# Altium schematic sheet Risc_V.SchDoc
size A4; SheetNumber: 6; SheetTotal: 7
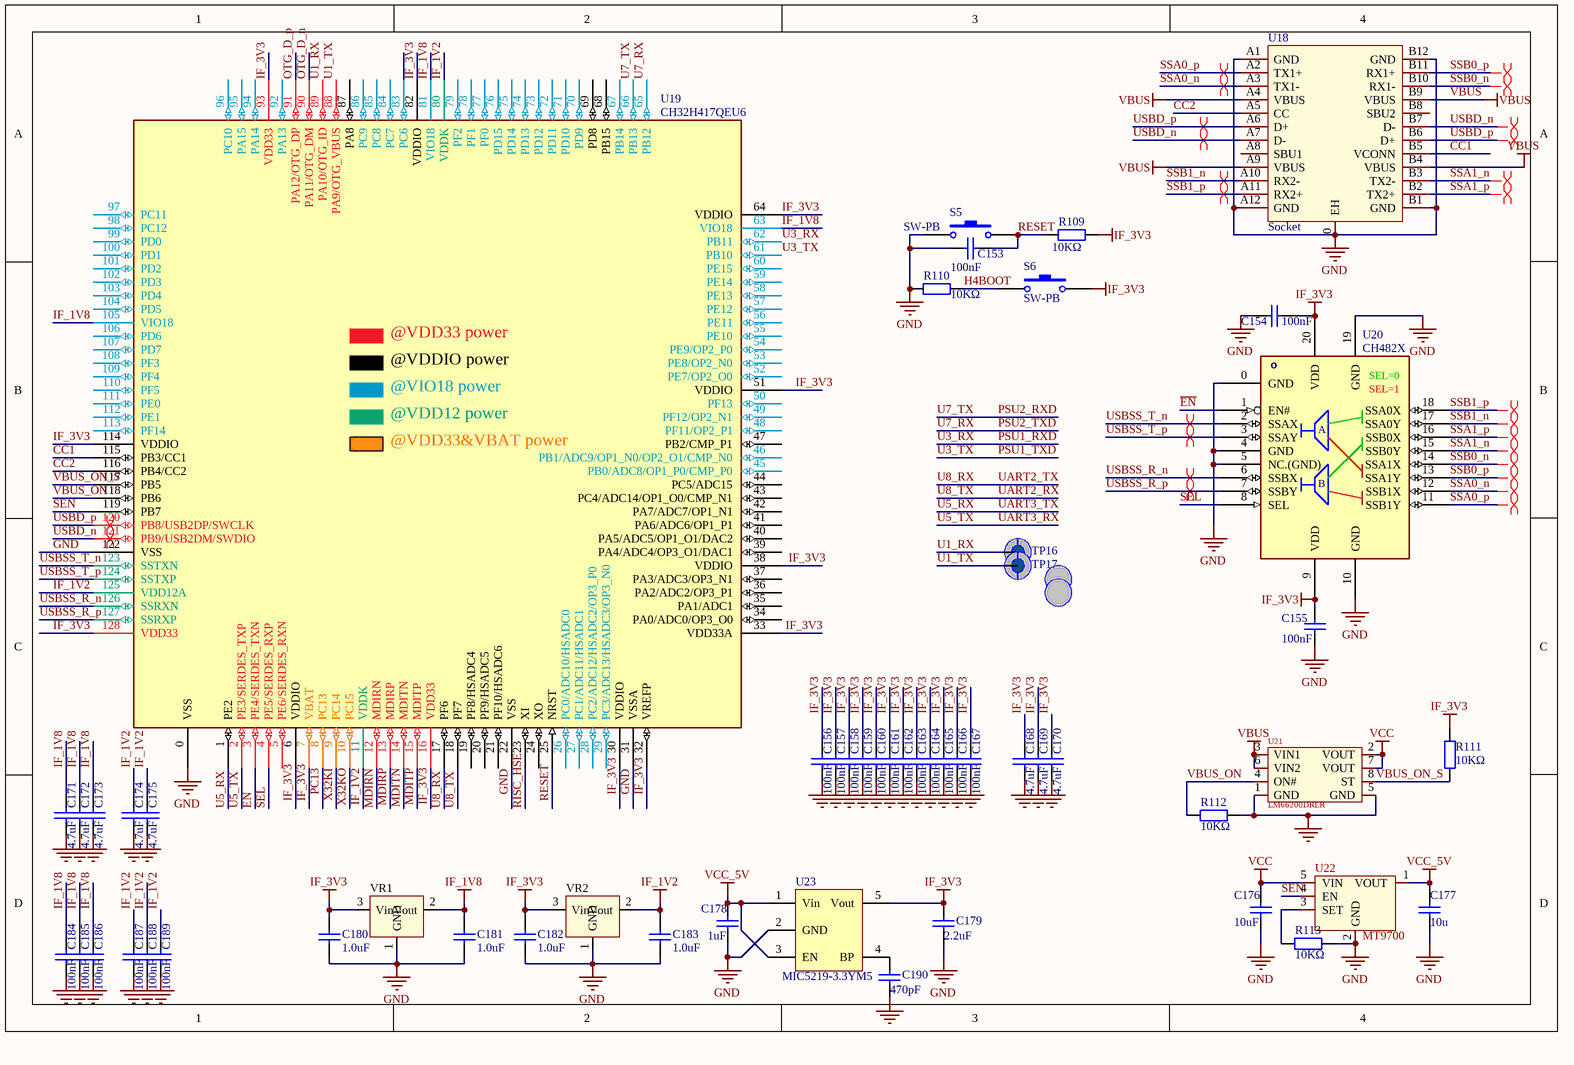
[diagram p0: Risc_V.SchDoc]

## Parts
C153  100nF  [0805_C]
C154  100nF  [0201]
C155  100nF  [0201]
C156  100nF  [0201]
C157  100nF  [0201]
C158  100nF  [0201]
C159  100nF  [0201]
C160  100nF  [0201]
C161  100nF  [0201]
C162  100nF  [0201]
C163  100nF  [0201]
C164  100nF  [0201]
C165  100nF  [0201]
C166  100nF  [0201]
C167  100nF  [0201]
C168  4.7uF  [0805_C]
C169  4.7uF  [0805_C]
C170  4.7uF  [0805_C]
C171  4.7uF  [0805_C]
C172  4.7uF  [0805_C]
C173  4.7uF  [0805_C]
C174  4.7uF  [0805_C]
C175  4.7uF  [0805_C]
C176  10uF  [0805_C]
C177  10u  [0805_C]
C178  1uF  [0805_C]
C179  2.2uF  [0805_C]
C180  1.0uF  [0805_C]
C181  1.0uF  [0805_C]
C182  1.0uF  [0805_C]
C183  1.0uF  [0805_C]
C184  100nF  [0201]
C185  100nF  [0201]
C186  100nF  [0201]
C187  100nF  [0201]
C188  100nF  [0201]
C189  100nF  [0201]
C190  470pF  [0805_C]
R109  10KΩ  [0805_R]
R110  10KΩ  [0805_R]
R111  10KΩ  [0805_R]
R112  10KΩ  [0201]
R113  10KΩ  [0805_R]
S5  SW-PB  [SW-3*4-2P]
S6  SW-PB  [SW-3*4-2P]
TP16  test-point  [POINT]  (value not drawn)
TP17  test-point  [POINT]  (value not drawn)
U18  Socket  [USB Type C 24pin全后贴]
U19  CH32H417QEU6  [QFN128_12.3X12.3]
U20  CH482X  [QFN20_2.5X4.5]
U21  LM66200DRLR  [SOT-583-8_L2.1-W1.2-P0.50-LS1.6-BL]
U22  MT9700  [SOT-23-5]
U23  MIC5219-3.3YM5  [SOT-23-5]
VR1  XC6206P332MR-G  [SOT-23-3_L2.9-W1.6-P1.90-LS2.8-BR]  (value not drawn)
VR2  XC6206P332MR-G  [SOT-23-3_L2.9-W1.6-P1.90-LS2.8-BR]  (value not drawn)

## Nets
GND: C153.1 C154.2 C155.1 C156.2 C157.1 C158.2 C159.2 C160.1 C161.2 C162.1 C163.2 C164.2 C165.1 C166.1 C167.1 C168.2 C169.2 C170.2 C171.2 C172.1 C173.2 C174.2 C175.1 C176.1 C177.1 C178.1 C179.1 C180.1 C181.1 C182.1 C183.1 C184.1 C185.1 C186.2 C187.1 C188.1 C189.1 C190.1 R110.1 R112.1 R113.1 S5.1 U18.0(EH) U18.A1(GND) U18.A12(GND) U18.B1(GND) U18.B12(GND) U19.0(VSS) U19.22(VSS) U19.31(VSSA) U19.122(VSS) U20.0(GND) U20.4(GND) U20.5(NC.(GND)) U20.10(GND) U20.19(GND) U21.1(GND) U21.5(GND) U22.2(GND) U23.2(GND) VR1.1(GND) VR2.1(GND)
IF_1V2: C174.1 C175.2 C183.2 C187.2 C188.2 C189.2 U19.11(VDDK) U19.80(VDDK) U19.125(VDD12A) VR2.2(Vout)
IF_1V8: C171.1 C172.2 C173.1 C181.2 C184.2 C185.2 C186.1 U19.63(VIO18) U19.81(VIO18) U19.105(VIO18) VR1.2(Vout)
IF_3V3: C154.1 C155.2 C156.1 C157.2 C158.1 C159.1 C160.2 C161.1 C162.2 C163.1 C164.1 C165.2 C166.2 C167.2 C168.1 C169.1 C170.1 C179.2 C180.2 C182.2 R109.2 R111.2 S6.2 U19.6(VDDIO) U19.7(VBAT) U19.16(VDD33) U19.30(VDDIO) U19.32(VREFP) U19.33(VDD33A) U19.38(VDDIO) U19.51(VDDIO) U19.64(VDDIO) U19.82(VDDIO) U19.93(VDD33) U19.114(VDDIO) U19.128(VDD33) U20.9(VDD) U20.20(VDD) U23.5(Vout) VR1.3(Vin) VR2.3(Vin)
VBUS: U18.A4(VBUS) U18.A9(VBUS) U18.B4(VBUS) U18.B9(VBUS) U21.3(VIN1) U21.6(VIN2)
VCC: C176.2 U21.2(VOUT) U21.7(VOUT) U22.5(VIN)
VCC_5V: C177.2 C178.2 U22.1(VOUT) U23.1(Vin) U23.3(EN)
CC1: U18.B5(VCONN) U19.115(PB3/CC1)
CC2: U18.A5(CC) U19.116(PB4/CC2)
~{EN}: U19.3(PE4/SERDES_TXN) U20.1(EN#)
H4BOOT: R110.2 S6.1
MDIRN: U19.12(MDIRN)
MDIRP: U19.13(MDIRP)
MDITN: U19.14(MDITN)
MDITP: U19.15(MDITP)
OTG_D_n: U19.90(PA11/OTG_DM)
OTG_D_p: U19.91(PA12/OTG_DP)
PC13: U19.8(PC13)
PSU1_RXD: U19.62(PB11)  [also labelled U3_RX]
PSU1_TXD: U19.61(PB10)  [also labelled U3_TX]
PSU2_RXD: U19.66(PB13)  [also labelled U7_TX]
PSU2_TXD: U19.65(PB12)  [also labelled U7_RX]
RESET: C153.2 R109.1 S5.2 U19.25(NRST)
RISC_HSE: U19.23(XI)
SEL: U19.4(PE5/SERDES_RXP) U20.8(SEL)
SEN: U19.119(PB7) U22.4(EN)
SSA0_n: U18.A3(TX1-) U20.12(SSB1X)
SSA0_p: U18.A2(TX1+) U20.11(SSB1Y)
SSA1_n: U18.B3(TX2-) U20.15(SSB0Y)
SSA1_p: U18.B2(TX2+) U20.16(SSB0X)
SSB0_n: U18.B10(RX1-) U20.14(SSA1X)
SSB0_p: U18.B11(RX1+) U20.13(SSA1Y)
SSB1_n: U18.A10(RX2-) U20.17(SSA0Y)
SSB1_p: U18.A11(RX2+) U20.18(SSA0X)
U1_RX: TP16.1(point) U19.89(PA10/OTG_ID)
U1_TX: TP17.1(point) U19.88(PA9/OTG_VBUS)
U5_RX: U19.1(PE2)  [also labelled UART3_TX]
U5_TX: U19.2(PE3/SERDES_TXP)  [also labelled UART3_RX]
U8_RX: U19.17(PF6)  [also labelled UART2_TX]
U8_TX: U19.18(PF7)  [also labelled UART2_RX]
USBD_n: U18.A7(D-) U18.B7(D-) U19.121(PB9/USB2DM/SWDIO)
USBD_p: U18.A6(D+) U18.B6(D+) U19.120(PB8/USB2DP/SWCLK)
USBSS_R_n: U19.126(SSRXN) U20.6(SSBX)
USBSS_R_p: U19.127(SSRXP) U20.7(SSBY)
USBSS_T_n: U19.123(SSTXN) U20.2(SSAX)
USBSS_T_p: U19.124(SSTXP) U20.3(SSAY)
VBUS_ON: R112.2 U19.118(PB6) U21.4(ON#)
VBUS_ON_S: R111.1 U19.117(PB5) U21.8(ST)
X32KI: U19.9(PC14)
X32KO: U19.10(PC15)
NetC190_2: C190.2 U23.4(BP)
NetR113_2: R113.2 U22.3(SET)

Not connected (* = marked no-connect by the designer): U18 A8(SBU1) B8(SBU2); U19 5(PE6/SERDES_RXN) 19(PF8/HSADC4) 20(PF9/HSADC5) 21(PF10/HSADC6) 24(XO) 26(PC0/ADC10/HSADC0) 27(PC1/ADC11/HSADC1) 28(PC2/ADC12/HSADC2/OP3_P0) 29(PC3/ADC13/HSADC3/OP3_N0) 34(PA0/ADC0/OP3_O0) 35(PA1/ADC1) 36(PA2/ADC2/OP3_P1) 37(PA3/ADC3/OP3_N1) 39(PA4/ADC4/OP3_O1/DAC1) 40(PA5/ADC5/OP1_O1/DAC2) 41(PA6/ADC6/OP1_P1) 42(PA7/ADC7/OP1_N1) 43(PC4/ADC14/OP1_O0/CMP_N1) 44(PC5/ADC15) 45(PB0/ADC8/OP1_P0/CMP_P0) 46(PB1/ADC9/OP1_N0/OP2_O1/CMP_N0) 47(PB2/CMP_P1) 48(PF11/OP2_P1) 49(PF12/OP2_N1) 50(PF13) 52(PE7/OP2_O0) 53(PE8/OP2_N0) 54(PE9/OP2_P0) 55(PE10) 56(PE11) 57(PE12) 58(PE13) 59(PE14) 60(PE15) 67(PB14) 68(PB15) 69(PD8) 70(PD9) 71(PD10) 72(PD11) 73(PD12) 74(PD13) 75(PD14) 76(PD15) 77(PF0) 78(PF1) 79(PF2) 83(PC6) 84(PC7) 85(PC8) 86(PC9) 87(PA8) 92(PA13) 94(PA14) 95(PA15) 96(PC10) 97(PC11) 98(PC12) 99(PD0) 100(PD1) 101(PD2) 102(PD3) 103(PD4) 104(PD5) 106(PD6) 107(PD7) 108(PF3) 109(PF4) 110(PF5) 111(PE0) 112(PE1) 113(PF14)

## Layout directives
differential pair: SSA0_n, SSA0_p, SSA1_n, SSA1_p, SSB0_n, SSB0_p, SSB1_n, SSB1_p, USBD_n, USBD_p, USBSS_R_n, USBSS_R_p, USBSS_T_n, USBSS_T_p

## Notes on the sheet
- (in symbol CH32H417QET6) @VDD33 power; @VDDIO power; @VIO18 power; @VDD12 power; @VDD33&VBAT power
- (in symbol CH482X) o; SEL=0; SEL=1; A; B

## Library data of the parts
C153-C167 C184-C189 = 0402 100nF (104) 10% 16V: 贴片电容; ComponentLink1Description: 供应商链接; ComponentLink1URL: http://www.szlcsc.com/product/details_1877.html; Package: 0402; Supplier: LC; SuppliersPartNumber: C1525
C168-C175 = CAP: Capacitor
C176 C177 = 0805 10uF (106) 10% 25V: 贴片电容; ComponentLink1Description: 供应商链接; ComponentLink1URL: http://www.szlcsc.com/product/details_16532.html; Package: 0805; Supplier: LC; SuppliersPartNumber: C15850
C178 C179 C190 = 0805 1uF (105) 10% 50V: 贴片电容; ComponentLink1Description: 供应商链接; ComponentLink1URL: http://www.szlcsc.com/product/details_29074.html; Package: 0805; Supplier: LC; SuppliersPartNumber: C28323
C180-C183 = 0402 1.0uF (105) 10% 25V: 贴片电容; ComponentLink1Description: 供应商链接; ComponentLink1URL: http://www.szlcsc.com/product/details_53938.html; Package: 0402; Supplier: LC; SuppliersPartNumber: C52923
R109 R110 = 0402 10KΩ (1002) 1%: 贴片电阻; ComponentLink1Description: 供应商链接; ComponentLink1URL: http://www.szlcsc.com/product/details_26487.html; Package: 0402; Supplier: LC; SuppliersPartNumber: C25744
R111-R113 = 0805 10KΩ (1002) 1%: 贴片电阻; ComponentLink1Description: 供应商链接; ComponentLink1URL: http://www.szlcsc.com/product/details_18102.html; Package: 0805; Supplier: LC; SuppliersPartNumber: C17414
S5 S6 = SW-PB: Switch; Published: 24-Mar-1999; LatestRevisionDate: 17-Jul-2002; LatestRevisionNote: Re-released for DXP Platform.; PackageReference: SPST-2; Publisher: Altium Limited; PackageDescription: Switch; 2 Leads
TP16 TP17 = test-point: 测试点
U18 = USB type C 沉板公头
U19 = CH32H417QET6: RISC-V FPU HD-MCU, 384MHz, USB3.0 & PD, 100M Ethernet, DVP, SDMMC, QSPI, OPA, ADC, DAC
U20 = CH482X: DP/PCIe/SATA/USB3.0/USB3.2 Differential Switch, QPDT
U21 = LM66200DRLR: 理想二极管; Manufacturer: TI(德州仪器); Add into BOM: yes; Symbol: LM66200DRLR; Device: LM66200DRLR; LCSC Part Name: LM66200DRLR; Supplier Part: C3235556; Manufacturer Part: LM66200DRLR; Supplier Footprint: SOT-583; JLCPCB Part Class: Extended Part; Datasheet: https://www.ti.com/cn/lit/gpn/lm66200; Supplier: LCSC; Convert to PCB: yes
U22 = MT9700: Manufacturer: 西安航天民芯; Add into BOM: yes; Symbol: MT9700; Device: MT9700; LCSC Part Name: MT9700 停产; Supplier Part: C89855; Manufacturer Part: MT9700; Supplier Footprint: SOT-23-5; JLCPCB Part Class: Extended Part; Datasheet: https://atta.szlcsc.com/upload/public/pdf/source/20170418/1492481333031.pdf; Supplier: LCSC; Convert to PCB: yes
U23 = RT9193-33: 3.3v低压差稳压芯片
VR1 VR2 = XC6206P332MR-G_C5446: 通用LDO; Manufacturer: TOREX(特瑞仕); Add into BOM: yes; Output Type: 固定; Voltage - Supply: 6V; Output Voltage: 3.3V; Output Current: 200mA; standby current: 1uA; Output Configuration: 正极; Number of Outputs: 1; Symbol: XC6206P332MR; Device: XC6206P332MR-G_C5446; LCSC Part Name: 输入6V 输出3.3V 200mA; Supplier Part: C5446; Manufacturer Part: XC6206P332MR-G; Supplier Footprint: SOT-23-3L; JLCPCB Part Class: Basic Part; Datasheet: https://item.szlcsc.com/datasheet/XC6206P332MR-G/5896.html; Supplier: LCSC; Convert to PCB: yes; Power Supply Rejection Ratio (PSRR): -; Voltage Dropout: -; Features: 过流保护; Operating Temperature: -40℃~+85℃@(Ta)